# Altium schematic sheet Superbot_LEDS.SchDoc
size A4
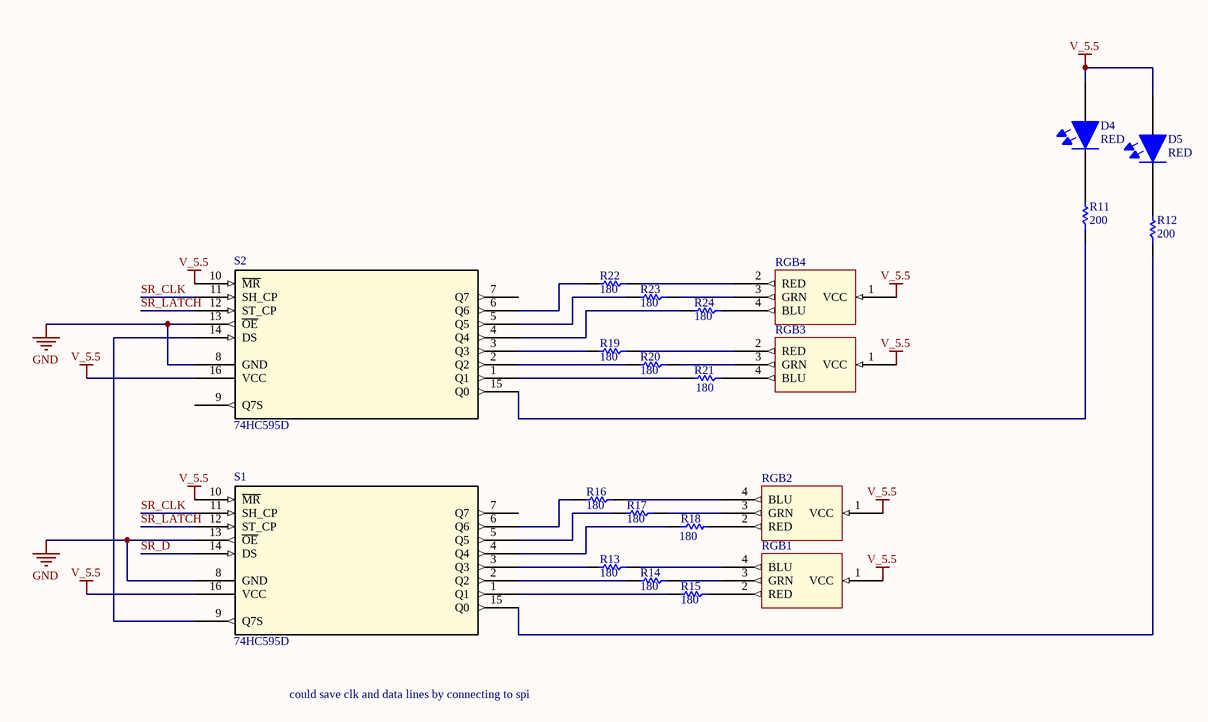
[diagram p0: Superbot_LEDS.SchDoc]

## Parts
D4  RED  [LED0603]
D5  RED  [LED0603]
R11  200  [RES0603R]
R12  200  [RES0603R]
R13  180  [RES0603R]
R14  180  [RES0603R]
R15  180  [RES0603R]
R16  180  [RES0603R]
R17  180  [RES0603R]
R18  180  [RES0603R]
R19  180  [RES0603R]
R20  180  [RES0603R]
R21  180  [RES0603R]
R22  180  [RES0603R]
R23  180  [RES0603R]
R24  180  [RES0603R]
RGB1  (no value)  [RGB LED]
RGB2  (no value)  [RGB LED]
RGB3  (no value)  [RGB LED]
RGB4  (no value)  [RGB LED]
S1  74HC595D  [SOT109-1-M]
S2  74HC595D  [SOT109-1-M]

## Nets
GND: S1.8(GND) S1.13(~{OE}) S2.8(GND) S2.13(~{OE})
V_5.5: D4.A(ANODE) D5.A(ANODE) RGB1.1(VCC) RGB2.1(VCC) RGB3.1(VCC) RGB4.1(VCC) S1.10(~{MR}) S1.16(VCC) S2.10(~{MR}) S2.16(VCC)
SR_CLK: S1.11(SH_CP) S2.11(SH_CP)
SR_D: S1.14(DS)
SR_LATCH: S1.12(ST_CP) S2.12(ST_CP)
NetD4_K: D4.K(CATHODE) R11.2
NetD5_K: D5.K(CATHODE) R12.2
NetR11_1: R11.1 S2.15(Q0)
NetR12_1: R12.1 S1.15(Q0)
NetR13_1: R13.1 RGB1.4(BLU)
NetR13_2: R13.2 S1.3(Q3)
NetR14_1: R14.1 RGB1.3(GRN)
NetR14_2: R14.2 S1.2(Q2)
NetR15_1: R15.1 RGB1.2(RED)
NetR15_2: R15.2 S1.1(Q1)
NetR16_1: R16.1 RGB2.4(BLU)
NetR16_2: R16.2 S1.6(Q6)
NetR17_1: R17.1 RGB2.3(GRN)
NetR17_2: R17.2 S1.5(Q5)
NetR18_1: R18.1 S1.4(Q4)
NetR18_2: R18.2 RGB2.2(RED)
NetR19_1: R19.1 RGB3.2(RED)
NetR19_2: R19.2 S2.3(Q3)
NetR20_1: R20.1 RGB3.3(GRN)
NetR20_2: R20.2 S2.2(Q2)
NetR21_1: R21.1 RGB3.4(BLU)
NetR21_2: R21.2 S2.1(Q1)
NetR22_1: R22.1 RGB4.2(RED)
NetR22_2: R22.2 S2.6(Q6)
NetR23_1: R23.1 RGB4.3(GRN)
NetR23_2: R23.2 S2.5(Q5)
NetR24_1: R24.1 RGB4.4(BLU)
NetR24_2: R24.2 S2.4(Q4)
NetS1_9: S1.9(Q7S) S2.14(DS)

Not connected (* = marked no-connect by the designer): S1 7(Q7); S2 7(Q7) 9(Q7S)

## Notes on the sheet
- could save clk and data lines by connecting to spi

## Library data of the parts
D4 D5 = LED: Color: RED; Supplier 1: Digikey
R11-R24 = R: Resistor; Supplier 1: Digikey; Supplier Part Number 1: *
  R11 R12: Value: 200
  R13-R24: Value: 180
RGB1-RGB4 = RGB LED: Red, Green, Blue (RGB) 622nm Red, 528nm Green, 468nm Blue LED Indication - Discrete 2V Red, 3.1V Green, 3.1V Blue 4-PLCC; Manufacturer: Cree Inc; Manufacturer Part Num: CLV1L-FKB-CJMNQEGBB7673673; Supplier 1: Digikey; Supplier Part Number 1: CLV1L-FKB-CJMNQEGBB7673673CT-ND
S1 S2 = 74HC595D: Shift Register; Vendor: NXP; Built_By: EMA_UL_Team; C: Copyright (C) 2015 Accelerated Designs. All rights reserved; Manufacturer_Part_Number: 74HC595D; Value: Value; Type: Type; RefDes: RefDes